# EAGLE design SimpleAudio Amplifier (EAGLE 6.2)
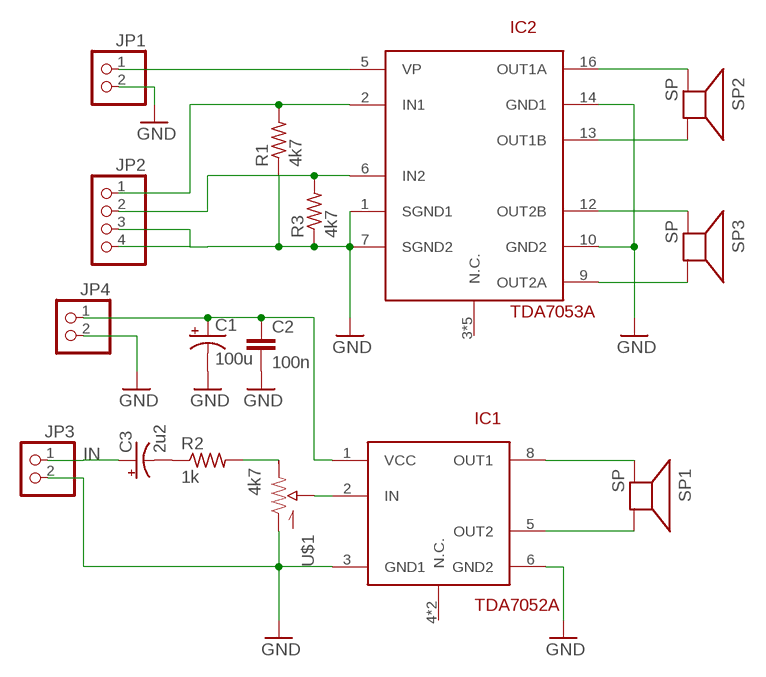
[diagram p0: schematic, sheet 1]

## Parts
C1  100u  CAP_POLPTH1  [CPOL-RADIAL-100UF-25V]
C2  100n  CAPPTH2  [CAP-PTH-SMALL2]
C3  2u2  CAP_POLPTH1  [CPOL-RADIAL-100UF-25V]
IC1  TDA7052A  [DIL08]
IC2  TDA7053A  [DIL16]
JP1  PINHD-1X2  [1X02]
JP2  PINHD-1X4  [1X04]
JP3  PINHD-1X2  [1X02]
JP4  PINHD-1X2  [1X02]
R1  4k7  R-US_0204/5  [0204/5]
R2  1k  R-US_0204/5  [0204/5]
R3  4k7  R-US_0204/5  [0204/5]
SP1  SP  [PS12]
SP2  SP  [PS12]
SP3  SP  [PS12]
U$1  4k7  POT-RV16AF-20  [POT_ALPHA_RV16AF-20]

## Nets
GND: C1.2(-) C2.2 IC1.3(GND1) IC1.6(GND2) IC2.1(SGND1) IC2.7(SGND2) IC2.10(GND2) IC2.14(GND1) JP1.2 JP2.3 JP2.4 JP3.2 JP4.2 R1.1 R3.1 U$1.1(A)
IN: C3.1(+) JP3.1
N$1: C1.1(+) C2.1 IC1.1(VCC) JP4.1
N$2: IC1.2(IN) U$1.2(S)
N$3: R2.2 U$1.3(E)
N$4: IC2.2(IN1) JP2.1 R1.2
N$5: C3.2(-) R2.1
N$6: IC2.6(IN2) JP2.2 R3.2
N$7: IC2.9(OUT2A) SP3.P$2(-)
N$8: IC1.8(OUT1) SP1.P$1(+)
N$9: IC1.5(OUT2) SP1.P$2(-)
N$10: IC2.12(OUT2B) SP3.P$1(+)
N$11: IC2.13(OUT1B) SP2.P$2(-)
N$12: IC2.16(OUT1A) SP2.P$1(+)
N$17: IC2.5(VP) JP1.1
Unconnected: IC1.4(N.C.) IC1.7(N.C.) IC2.3(N.C.) IC2.4(N.C.) IC2.8(N.C.) IC2.11(N.C.) IC2.15(N.C.)

## Library data of the parts
C1 C3 = SparkFun:CAP_POL: Capacitor Polarized These are standard SMD and PTH capacitors. Normally 10uF, 47uF, and 100uF in electrolytic and tantalum varieties. Always verify the external diameter of the through hole cap, it varies with capacity, voltage, and manufacturer. The EIA devices should be standard.
C2 = SparkFun:CAP: Capacitor Standard 0603 ceramic capacitor, and 0.1" leaded capacitor.
IC1 = My Library:TDA7052: AUDIO AMPLIFIER
IC2 = My Library:TDA7053: AUDIO AMPLIFIER
JP1 JP3 JP4 = pinhead:PINHD-1X2: PIN HEADER
JP2 = pinhead:PINHD-1X4: PIN HEADER
R1-R3 = adafruit:R-US_: RESISTOR, American symbol
SP1-SP3 = My Library:SP: SPEAKER Source: Buerklin Added PS12 (for part # PS1240 piezo) http://www.ladyada.net/library/pcb/eaglelibrary.html
U$1 = My Library:POT

## Board
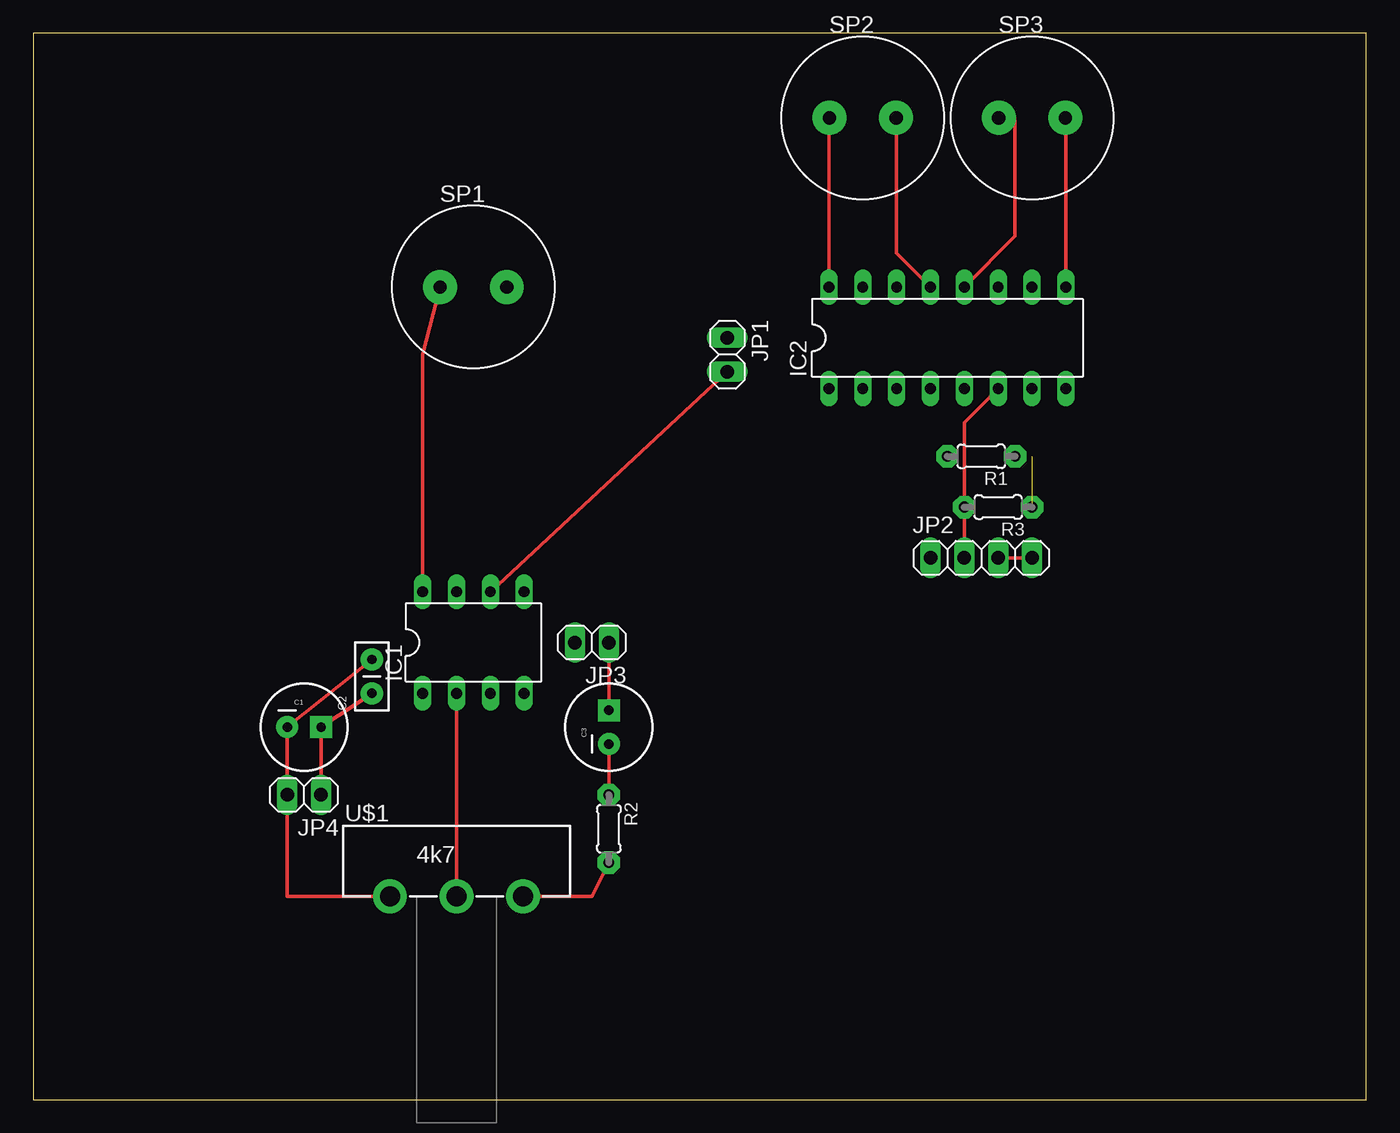
[diagram p1: board, top side]
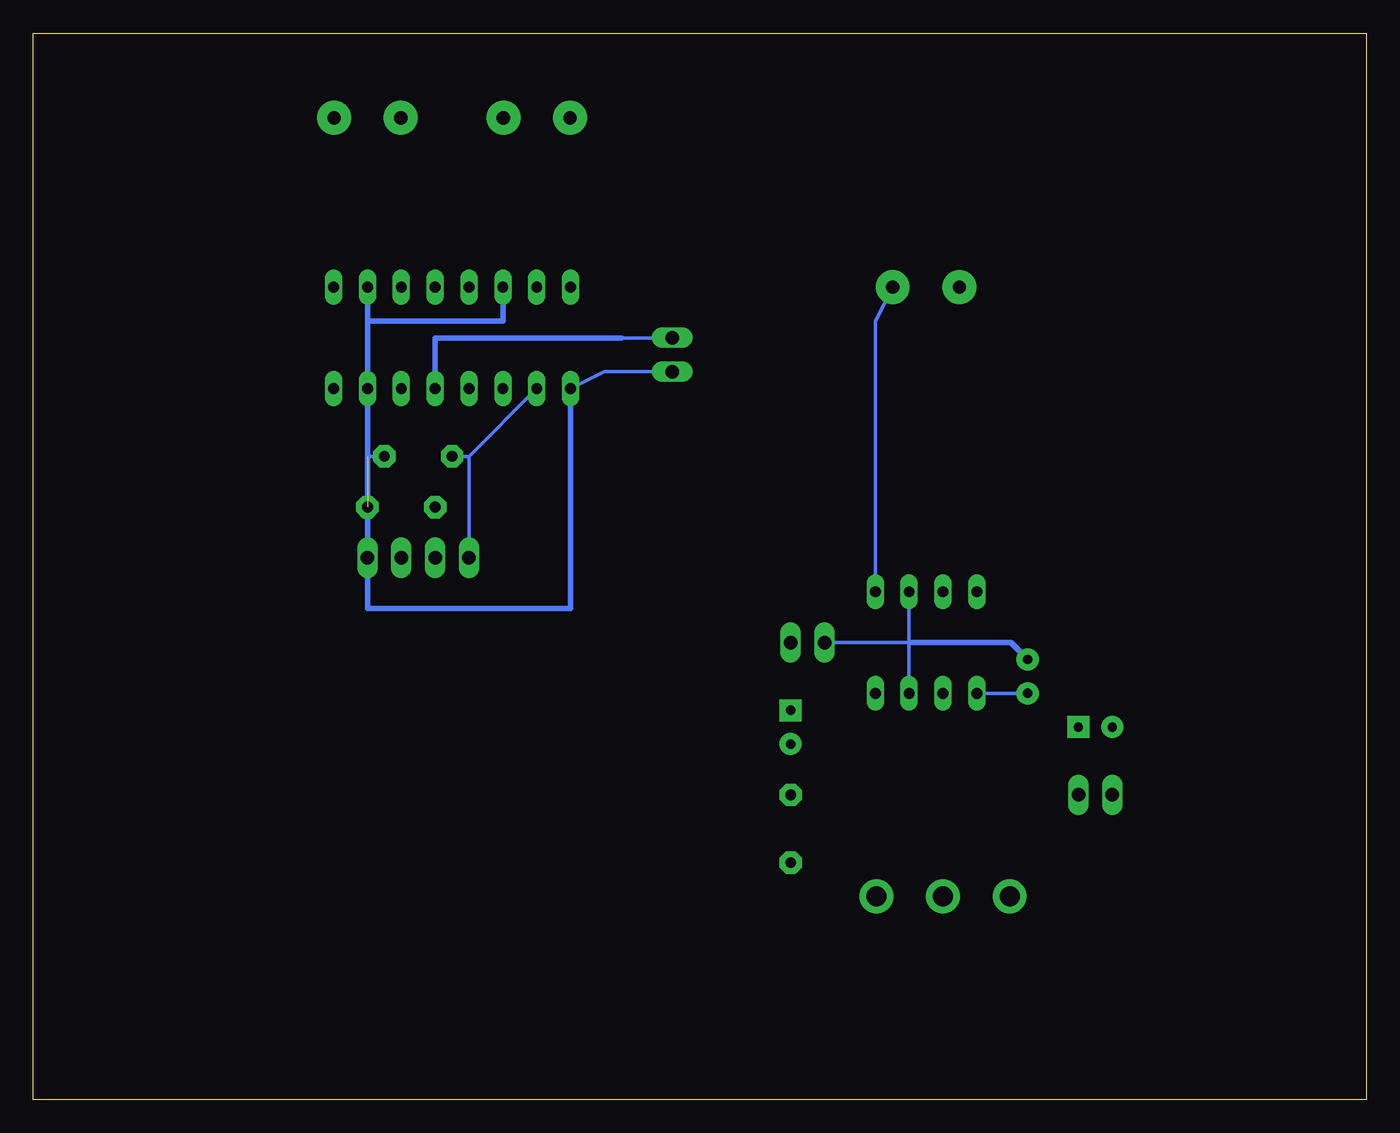
[diagram p2: board, bottom side, seen from below]

Size 100 x 80 mm. Coordinates in mm from the lower left corner, seen from the top.
Outline: 0,0 100,0 100,80 0,80 0,0
Copper layers (1*16): Top 0.035mm / dielectric 1.5mm / Bottom 0.035mm
Design rules: minimum track width 10mil, minimum drill 24mil, track to track 8mil, track to pad 8mil, pad to pad 8mil, via to via 8mil, smd to smd 8mil, copper to edge 40mil, drill to drill 8mil, minimum pad ring 10mil, minimum via ring 8mil, stop-mask expansion 4mil, vias tented up to drill 0mil, thermal gap 10mil

### Footprints (pad centres in the part's own frame; a part is rotated, then mirrored left to right if it is on the bottom)
CPOL-RADIAL-100UF-25V = drill 0.7 pad 1.651 square: 1 1.27,0 | drill 0.7 pad 1.651: 2 -1.27,0
CAP-PTH-SMALL2 = drill 0.7 pad 1.651: 1 0,0; 2 2.54,0
DIL08 = drill 0.813 long: 1 -3.81,-3.81; 2 -1.27,-3.81; 3 1.27,-3.81; 4 3.81,-3.81; 5 3.81,3.81; 6 1.27,3.81; 7 -1.27,3.81; 8 -3.81,3.81
DIL16 = drill 0.813 long: 1 -8.89,-3.81; 2 -6.35,-3.81; 3 -3.81,-3.81; 4 -1.27,-3.81; 5 1.27,-3.81; 6 3.81,-3.81; 7 6.35,-3.81; 8 8.89,-3.81; 9 8.89,3.81; 10 6.35,3.81; 11 3.81,3.81; 12 1.27,3.81; 13 -1.27,3.81; 14 -3.81,3.81; 15 -6.35,3.81; 16 -8.89,3.81
1X02 = drill 1.016 long: 1 -1.27,0; 2 1.27,0
1X04 = drill 1.016 long: 1 -3.81,0; 2 -1.27,0; 3 1.27,0; 4 3.81,0
0204/5 = drill 0.813 pad 1.676 octagon: 1 -2.54,0; 2 2.54,0
PS12 = drill 1 pad 2.54: P$1 -2.5,0; P$2 2.5,0
POT_ALPHA_RV16AF-20 = drill 1.5 pad 2.54: 1 -5,0; 2 0,0; 3 5,0

### Placement (x,y rotation side)
C1  20.32,27.94 0 top
C2  25.4,30.48 90 top
C3  43.18,27.94 90 top
IC1  33.02,34.29 0 top
IC2  68.58,57.15 0 top
JP1  52.07,55.88 270 top
JP2  71.12,40.64 0 top
JP3  41.91,34.29 180 top
JP4  20.32,22.86 180 top
R1  71.12,48.26 180 top
R2  43.18,20.32 270 top
R3  72.39,44.45 180 top
SP1  33.02,60.96 0 top
SP2  62.23,73.66 0 top
SP3  74.93,73.66 0 top
U$1  31.75,15.24 0 top

### Tracks (layer width: path | path; a pad name or v marks a point on that pad's centre or on a via)
GND  (1 unrouted)
  Top 0.254: U$1.1 21.59,15.24 19.05,15.24 JP4.2 C1.2 C2.2 | JP1.2 IC1.6 | JP2.4 JP2.3
  Bottom 0.254: IC1.6 34.29,34.29 | 34.29,34.29 IC1.3 | 34.29,34.29 JP3.2 | 74.93,48.26 R1.1 | IC2.1 57.15,54.61 JP1.2
  Bottom 0.406: C2.2 26.67,34.29 34.29,34.29 | IC2.1 59.69,36.83 74.93,36.83 JP2.4 74.93,48.26 IC2.7 | IC2.7 74.93,58.42 | 74.93,58.42 IC2.10 | IC2.7 74.93,58.42 | IC2.14 64.77,58.42 74.93,58.42
IN
  Top 0.254: C3.1 JP3.1
N$1
  Top 0.254: JP4.1 C1.1 C2.1
  Bottom 0.254: IC1.1 27.94,30.48 C2.1
N$2
  Top 0.254: U$1.2 IC1.2
N$3
  Top 0.254: R2.2 41.91,15.24 40.64,15.24 U$1.3
N$4
  Bottom 0.254: 67.31,48.26 IC2.2 | R1.2 67.31,48.26 | 67.31,48.26 JP2.1
N$5
  Top 0.254: C3.2 43.18,25.4 R2.1
N$6
  Top 0.254: IC2.6 69.85,50.8 R3.2 JP2.2
N$7
  Top 0.254: IC2.9 77.47,73.66 SP3.P$2
N$8
  Top 0.254: IC1.8 29.21,55.88 SP1.P$1
N$9
  Bottom 0.254: IC1.5 36.83,54.61 36.83,58.42 SP1.P$2
N$10
  Top 0.254: IC2.12 73.66,64.77 73.66,73.66 SP3.P$1
N$11
  Top 0.254: IC2.13 64.77,63.5 64.77,73.66 SP2.P$2
N$12
  Top 0.254: IC2.16 59.69,73.66 SP2.P$1
N$17
  Bottom 0.254: JP1.1 53.34,57.15 55.88,57.15
  Bottom 0.406: IC2.5 69.85,57.15 55.88,57.15